# EAGLE design scaleShield (EAGLE 6.2)
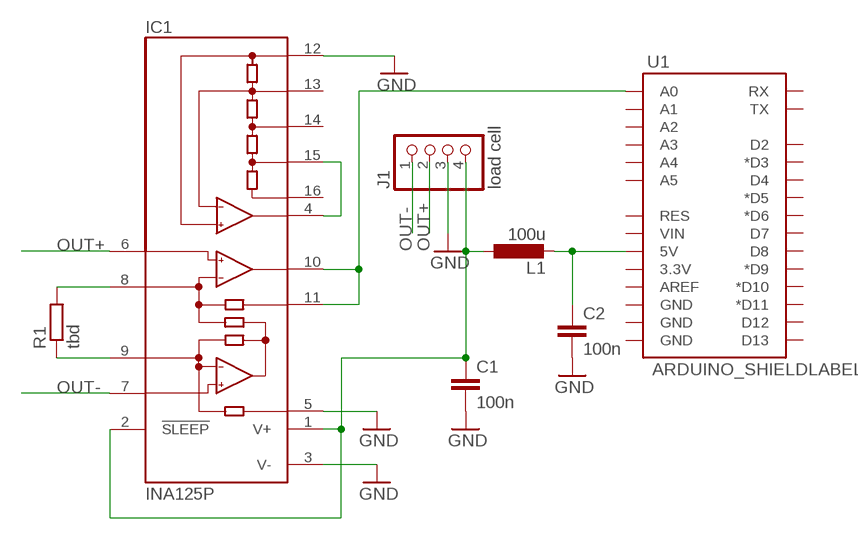
[diagram p0: schematic, sheet 1]

## Parts
C1  100n  C-EU025-025X050  [C025-025X050]
C2  100n  C-EU025-025X050  [C025-025X050]
IC1  INA125P  [DIL16]
J1  load cell  PINHD-1X4  [1X04]
L1  100u  L-EU0207/10  [0207/10]
R1  tbd  R-EU_0207/10  [0207/10]
U1  ARDUINO_SHIELDLABEL  [DUEMILANOVE_SHIELD]

## Nets
GND: C1.2 C2.2 IC1.3(V-) IC1.5(REF) IC1.12(REFCOM) J1.3
N$1: IC1.10(OUT) IC1.11(SENSE) U1.A0
N$2: C2.1 L1.2 U1.5V
N$3: IC1.4(REFOUT) IC1.15(REF5)
N$4: IC1.8(RG) R1.2
N$5: IC1.9(RG) R1.1
OUT+: IC1.6(+IN) J1.2
OUT-: IC1.7(-IN) J1.1
WIRE: C1.1 IC1.1(V+) IC1.2(!SLEEP) J1.4 L1.1
Unconnected: IC1.13(REFBG) IC1.14(REF2.5) IC1.16(REF10) U1.3.3V U1.A1 U1.A2 U1.A3 U1.A4 U1.A5 U1.AREF U1.D2 U1.D3(*D3) U1.D4 U1.D5(*D5) U1.D6(*D6) U1.D7 U1.D8 U1.D9(*D9) U1.D10(*D10) U1.D11(*D11) U1.D12 U1.D13 U1.GND@0(GND) U1.GND@1(GND) U1.GND@2(GND) U1.RES U1.RX U1.TX U1.VIN

## Library data of the parts
C1 C2 = rcl:C-EU: CAPACITOR, European symbol
IC1 = burr-brown:INA125: Instrumentation Amplifier with Precision Voltage Reference; MF: TEXAS INSTRUMENT CONNECTORS; MPN: INA125P; OC_FARNELL: 1459461; OC_NEWARK: 35C1726
J1 = pinhead:PINHD-1X4: PIN HEADER
L1 = resistor:L-EU: INDUCTOR, European symbol
R1 = resistor:R-EU_: RESISTOR, European symbol
U1 = SparkFun-Boards:ARDUINO_SHIELD: Arduino shield footprint

## Board
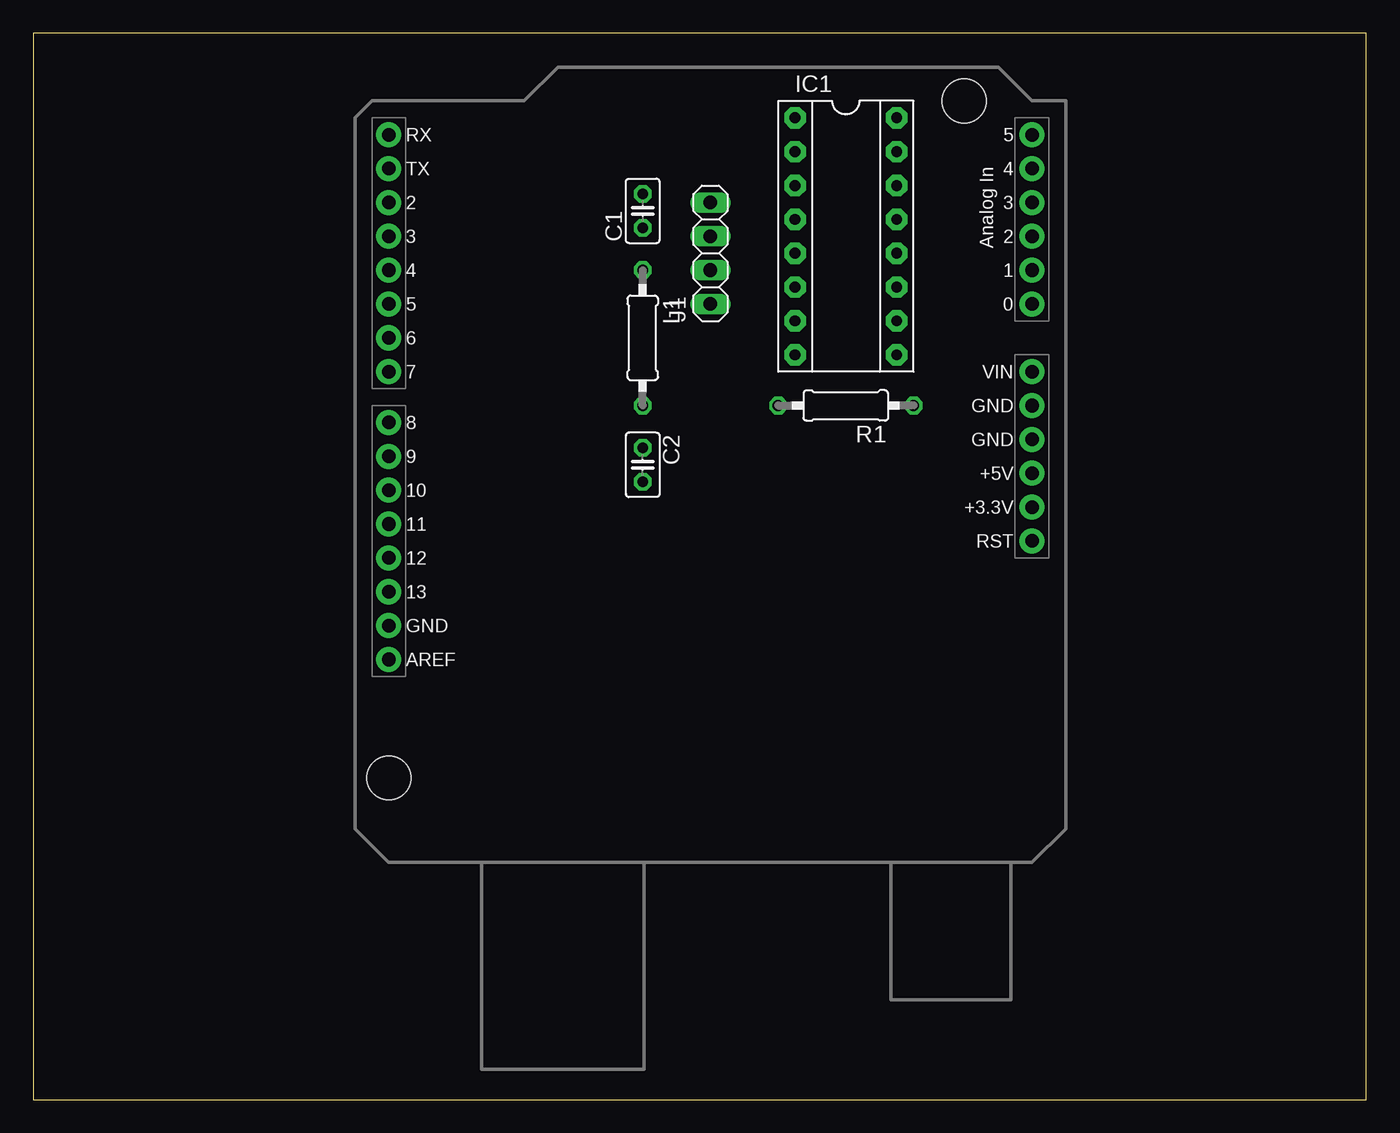
[diagram p1: board, top side]
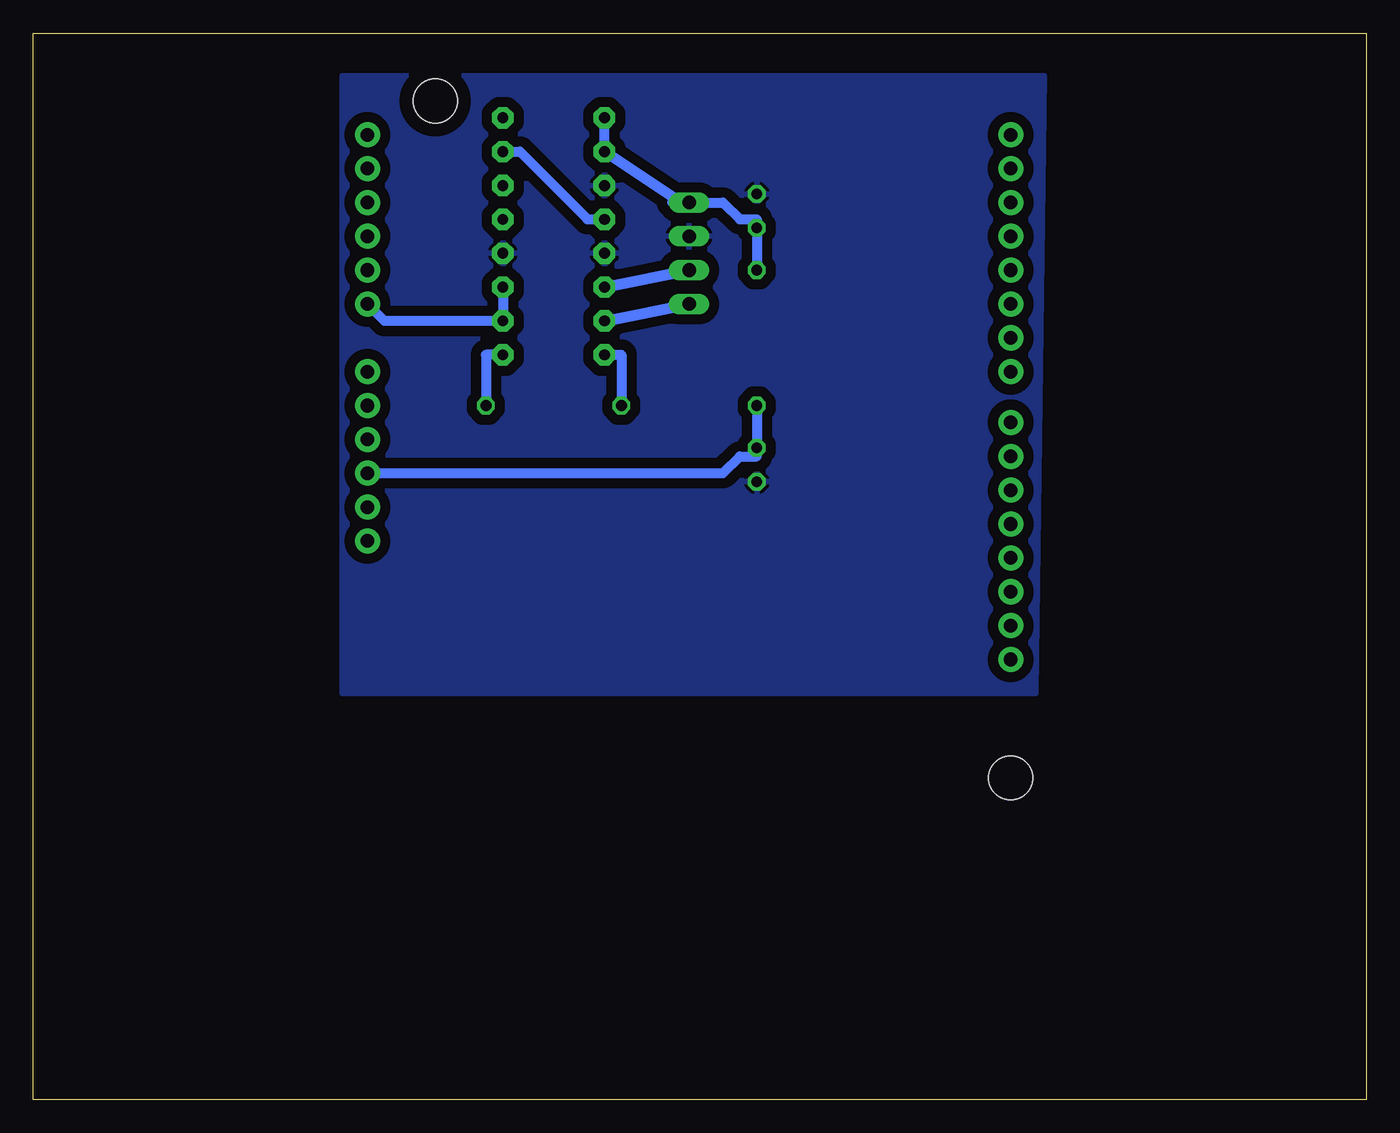
[diagram p2: board, bottom side, seen from below]

Size 100 x 80 mm. Coordinates in mm from the lower left corner, seen from the top.
Outline: 0,0 100,0 100,80 0,80 0,0
Copper layers (1*16): Top 0.035mm / dielectric 1.5mm / Bottom 0.035mm
Design rules: minimum track width 30mil, minimum drill 24mil, track to track 30mil, track to pad 30mil, pad to pad 30mil, via to via 30mil, smd to smd 15mil, copper to edge 40mil, drill to drill 8mil, minimum pad ring 10mil, minimum via ring 8mil, stop-mask expansion 4mil, vias tented up to drill 0mil, thermal gap 10mil

### Footprints (pad centres in the part's own frame; a part is rotated, then mirrored left to right if it is on the bottom)
C025-025X050 = drill 0.813 octagon: 1 -1.27,0; 2 1.27,0
DIL16 = drill 0.813 pad 1.6 octagon: 1 -8.89,-3.81; 2 -6.35,-3.81; 3 -3.81,-3.81; 4 -1.27,-3.81; 5 1.27,-3.81; 6 3.81,-3.81; 7 6.35,-3.81; 8 8.89,-3.81; 9 8.89,3.81; 10 6.35,3.81; 11 3.81,3.81; 12 1.27,3.81; 13 -1.27,3.81; 14 -3.81,3.81; 15 -6.35,3.81; 16 -8.89,3.81
1X04 = drill 1.016 long: 1 -3.81,0; 2 -1.27,0; 3 1.27,0; 4 3.81,0
0207/10 = drill 0.813 octagon: 1 -5.08,0; 2 5.08,0
DUEMILANOVE_SHIELD = drill 1.016 pad 1.88: 3.3V 50.8,26.67; 5V 50.8,29.21; A0 50.8,41.91; A1 50.8,44.45; A2 50.8,46.99; A3 50.8,49.53; A4 50.8,52.07; A5 50.8,54.61; AREF 2.54,15.24; D2 2.54,49.53; D3 2.54,46.99; D4 2.54,44.45; D5 2.54,41.91; D6 2.54,39.37; D7 2.54,36.83; D8 2.54,33.02; D9 2.54,30.48; D10 2.54,27.94; D11 2.54,25.4; D12 2.54,22.86; D13 2.54,20.32; GND@0 50.8,31.75; GND@1 50.8,34.29; GND@2 2.54,17.78; RES 50.8,24.13; RX 2.54,54.61; TX 2.54,52.07; VIN 50.8,36.83 | hole 3.302: 45.72,57.15; 2.54,6.35

### Placement (x,y rotation side)
C1  45.72,66.67 90 top
C2  45.72,47.62 270 top
IC1  60.96,64.77 270 top
J1  50.8,63.5 90 top
L1  45.72,57.15 270 top
R1  60.96,52.07 180 top
U1  24.13,17.78 0 top

### Tracks (layer width: path | path; a pad name or v marks a point on that pad's centre or on a via)
GND
  pour Bottom: 24.13,76.83 24.77,30.48 76.83,30.48 76.83,76.83
N$1
  Bottom 0.762: IC1.11 IC1.10 73.66,58.42 U1.A0
N$2
  Bottom 0.762: L1.2 C2.1 45.72,48.26 46.99,48.26 48.26,46.99 U1.5V
N$3
  Bottom 0.762: IC1.4 58.42,66.04 63.5,71.12 IC1.15
N$4
  Bottom 0.762: R1.2 55.88,55.88 IC1.8
N$5
  Bottom 0.762: R1.1 66.04,55.88 IC1.9
OUT+
  Bottom 0.813: IC1.6 J1.2
OUT-
  Bottom 0.813: IC1.7 J1.1
WIRE
  Bottom 0.762: L1.1 C1.1 45.72,66.04 46.99,66.04 48.26,67.31 J1.4 52.07,67.31 51.88,67.6 | IC1.2 IC1.1
  Bottom 0.813: 51.44,67.31 51.88,67.6 IC1.2